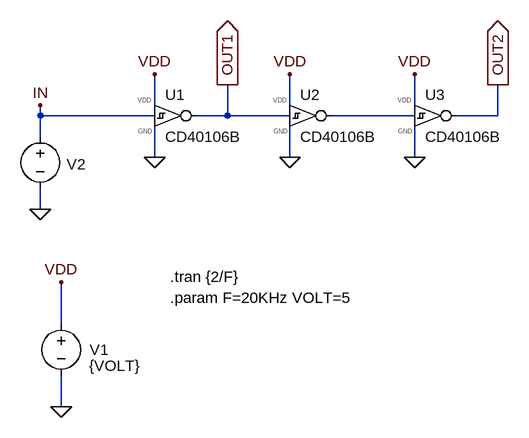
[diagram p0: schematic CD40106.asc]
CD40106.asc, the LTspice schematic file:
Version 4.1
SHEET 1 880 756
WIRE 256 272 256 224
WIRE 464 272 464 224
WIRE 656 272 656 224
WIRE 80 288 80 272
WIRE 256 288 80 288
WIRE 368 288 368 240
WIRE 368 288 320 288
WIRE 464 288 368 288
WIRE 656 288 528 288
WIRE 784 288 784 240
WIRE 784 288 720 288
WIRE 80 320 80 288
WIRE 256 352 256 304
WIRE 464 352 464 304
WIRE 656 352 656 304
WIRE 80 432 80 400
WIRE 112 608 112 544
WIRE 112 736 112 688
FLAG 368 240 OUT1
IOPIN 368 240 Out
FLAG 112 736 0
FLAG 112 544 VDD
FLAG 256 224 VDD
FLAG 256 352 0
FLAG 80 432 0
FLAG 80 272 IN
FLAG 464 224 VDD
FLAG 464 352 0
FLAG 656 224 VDD
FLAG 656 352 0
FLAG 784 240 OUT2
IOPIN 784 240 Out
SYMBOL voltage 112 592 R0
WINDOW 123 0 0 Left 0
WINDOW 39 0 0 Left 0
WINDOW 0 44 56 Left 2
WINDOW 3 43 81 Left 2
SYMATTR InstName V1
SYMATTR Value {VOLT}
SYMBOL voltage 80 304 R0
WINDOW 0 41 59 Left 2
WINDOW 3 33 98 Invisible 2
WINDOW 123 0 0 Left 0
WINDOW 39 0 0 Left 0
SYMATTR InstName V2
SYMATTR Value SINE({VOLT/2} {VOLT/2} {F})
SYMBOL MyLib\\Digital\\CD40106B 256 256 R0
SYMATTR InstName U1
SYMATTR SpiceLine2 speed=2 tripdt=100n
SYMBOL MyLib\\Digital\\CD40106B 464 256 R0
SYMATTR InstName U2
SYMATTR SpiceLine2 speed=2 tripdt=100n
SYMBOL MyLib\\Digital\\CD40106B 656 256 R0
SYMATTR InstName U3
SYMATTR SpiceLine2 speed=2 tripdt=100n
TEXT 280 536 Left 2 !.tran {2/F}
TEXT 280 568 Left 2 !.param F=20KHz VOLT=5

The netlist it stands for:
* CD40106.asc
V1 VDD 0 {VOLT}
V2 IN 0 SINE({VOLT/2} {VOLT/2} {F})
X§U1 IN OUT1 VDD 0 CD40106B vdd=5 speed=2 tripdt=100n  ; pins in out VDD GND
X§U2 OUT1 N001 VDD 0 CD40106B vdd=5 speed=2 tripdt=100n  ; pins in out VDD GND
X§U3 N001 OUT2 VDD 0 CD40106B vdd=5 speed=2 tripdt=100n  ; pins in out VDD GND
.tran {2/F}
.param F=20KHz VOLT=5
.lib MyLib/Digital/_CD4xxx.lib
.backanno
.end